# EAGLE design sch_v4_cdr (EAGLE 9.6.2)

## Sheet 1 of 6: SYSTEME DE DEMARRAGE
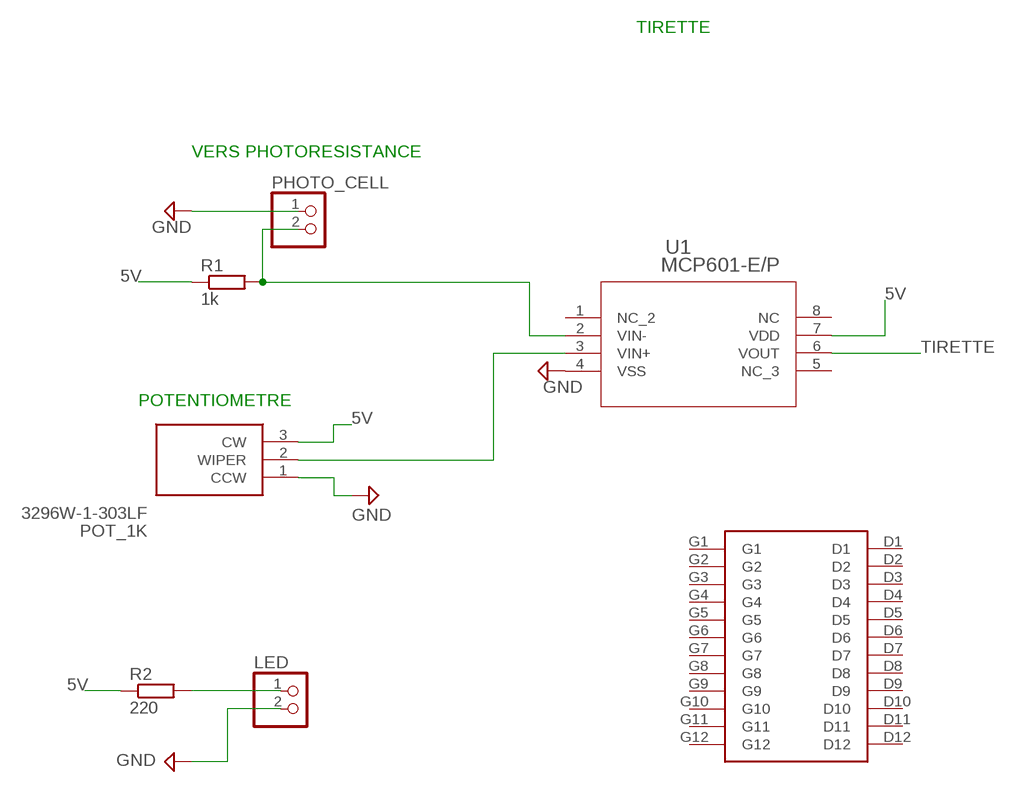
[diagram p0: schematic, sheet 1]

### Parts
LED  PINHD-1X2  [1X02]
PHOTO_CELL  PINHD-1X2  [1X02]
POT_1K  3296W-1-303LF  [3296W-1]
R1  1k  R-EU_0204/7  [0204/7]
R2  220  R-EU_0204/7  [0204/7]
U1  MCP601-E/P  [PDIP8_300MC_MCH]
U$5  MATRIX_12X12  [MATRIX_12X12]

### Nets
5V: POT_1K.3(CW) R1.1 R2.1 U1.7(VDD) ; also sheet 2,4,5
GND: LED.2 PHOTO_CELL.1 POT_1K.1(CCW) U1.4(VSS) ; also sheet 2,3,4,5,6
N$1: PHOTO_CELL.2 R1.2 U1.2(VIN-)
N$2: POT_1K.2(WIPER) U1.3(VIN+)
N$3: LED.1 R2.2
TIRETTE: U1.6(VOUT) ; also sheet 2
Unconnected: U1.1(NC_2) U1.5(NC_3) U1.8(NC) U$5.D1 U$5.D2 U$5.D3 U$5.D4 U$5.D5 U$5.D6 U$5.D7 U$5.D8 U$5.D9 U$5.D10 U$5.D11 U$5.D12 U$5.G1 U$5.G2 U$5.G3 U$5.G4 U$5.G5 U$5.G6 U$5.G7 U$5.G8 U$5.G9 U$5.G10 U$5.G11 U$5.G12

### Notes on the sheet
- TIRETTE
- VERS PHOTORESISTANCE
- POTENTIOMETRE

## Sheet 2 of 6: INTELLIGENCE
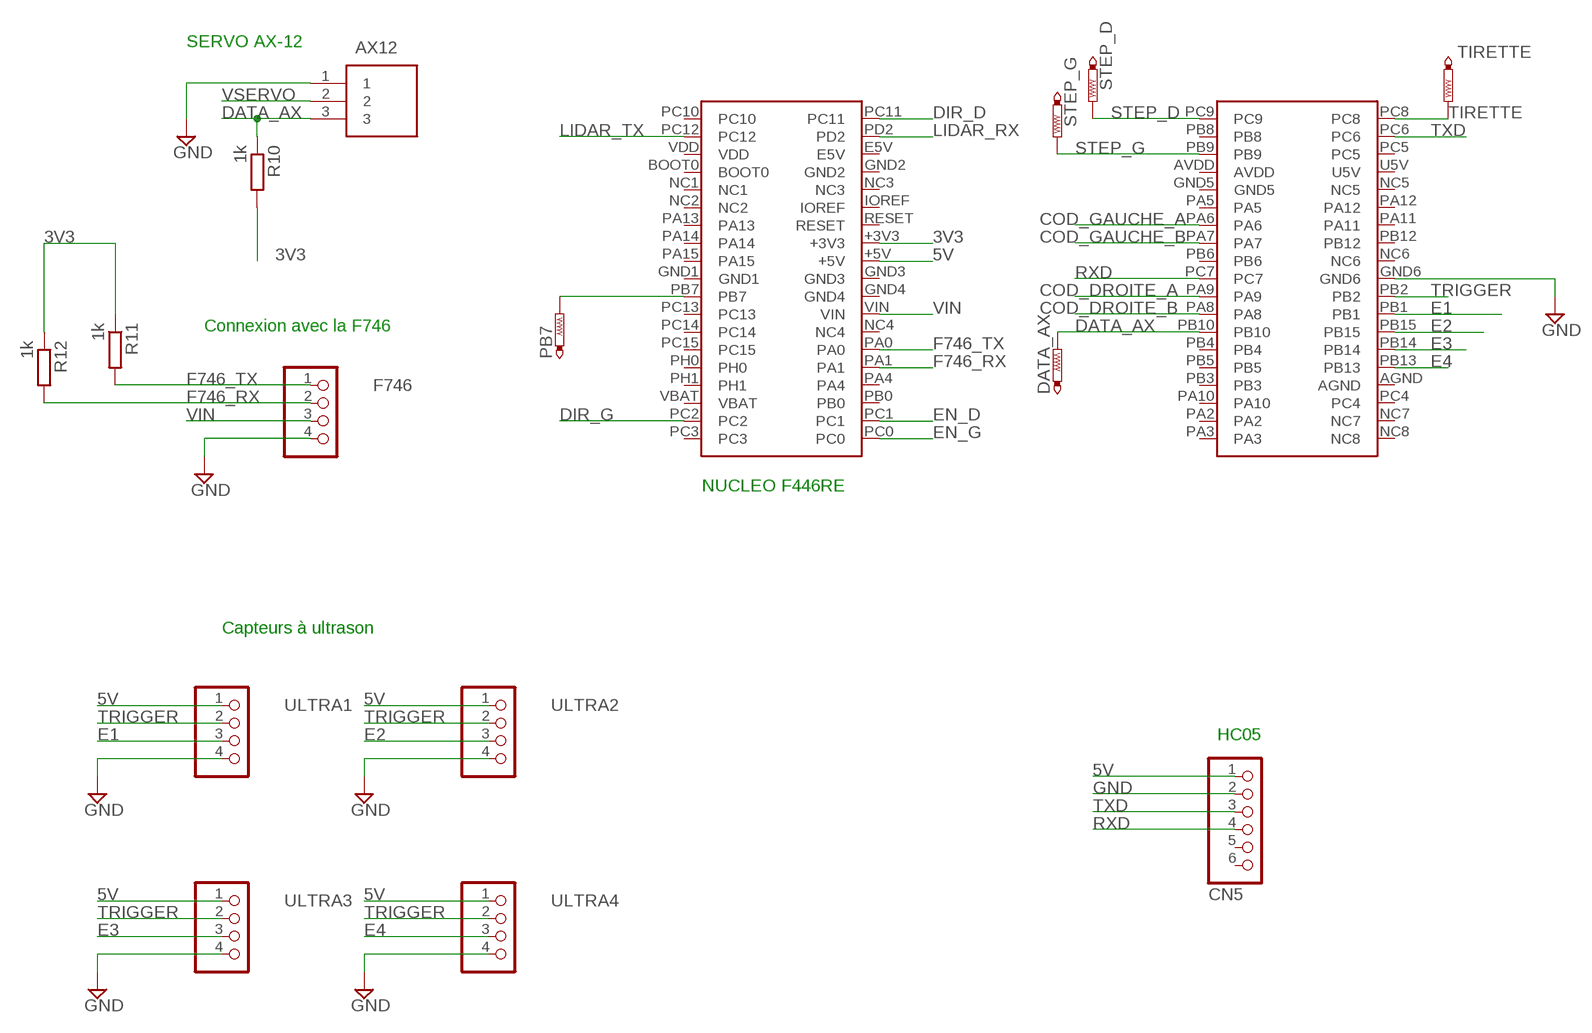
[diagram p1: schematic, sheet 2]

### Parts
AX12  22-03-5035  [SHDR3W60P0X250_1X3_990X490X590]
DATA_AX  PTR1PAD1-13  [P1-13]
F746  PINHD-1X4  [1X04]
JP4  CN5  PINHD-1X6  [1X06]
PB7  PTR1PAD1-13  [P1-13]
R10  1k  R-EU_0204/7  [0204/7]
R11  1k  R-EU_0204/7  [0204/7]
R12  1k  R-EU_0204/7  [0204/7]
STEP_D  PTR1PAD1-13  [P1-13]
STEP_G  PTR1PAD1-13  [P1-13]
TIRETTE  PTR1PAD1-13  [P1-13]
U$1  NUCLEO_F446RE  [MB1136]
ULTRA1  PINHD-1X4  [1X04]
ULTRA2  PINHD-1X4  [1X04]
ULTRA3  PINHD-1X4  [1X04]
ULTRA4  PINHD-1X4  [1X04]

### Nets
3V3: R10.2 R11.1 R12.1 U$1.+3V3
5V: JP4.1 U$1.+5V ULTRA1.1 ULTRA2.1 ULTRA3.1 ULTRA4.1 ; also sheet 1,4,5
COD_DROITE_A: U$1.PA9 ; also sheet 5
COD_DROITE_B: U$1.PA8 ; also sheet 5
COD_GAUCHE_A: U$1.PA6 ; also sheet 5
COD_GAUCHE_B: U$1.PA7 ; also sheet 5
DATA_AX: AX12.3 DATA_AX.TP R10.1 U$1.PB10
DIR_D: U$1.PC11 ; also sheet 4
DIR_G: U$1.PC2 ; also sheet 4
E1: U$1.PB1 ULTRA1.3
E2: U$1.PB15 ULTRA2.3
E3: U$1.PB14 ULTRA3.3
E4: U$1.PB13 ULTRA4.3
EN_D: U$1.PC1 ; also sheet 4
EN_G: U$1.PC0 ; also sheet 4
F746_RX: F746.2 R12.2 U$1.PA1
F746_TX: F746.1 R11.2 U$1.PA0
GND: AX12.1 F746.4 JP4.2 U$1.GND6 ULTRA1.4 ULTRA2.4 ULTRA3.4 ULTRA4.4 ; also sheet 1,3,4,5,6
LIDAR_RX: U$1.PD2 ; also sheet 6
LIDAR_TX: U$1.PC12 ; also sheet 6
N$4: PB7.TP U$1.PB7
RXD: JP4.4 U$1.PC7
STEP_D: STEP_D.TP U$1.PC9 ; also sheet 4
STEP_G: STEP_G.TP U$1.PB9 ; also sheet 4
TIRETTE: TIRETTE.TP U$1.PC8 ; also sheet 1
TRIGGER: U$1.PB2 ULTRA1.2 ULTRA2.2 ULTRA3.2 ULTRA4.2
TXD: JP4.3 U$1.PC6
VIN: F746.3 U$1.VIN ; also sheet 3,6
VSERVO: AX12.2 ; also sheet 3,6
Unconnected: JP4.5 JP4.6 U$1.AGND U$1.AVDD U$1.BOOT0 U$1.E5V U$1.GND1 U$1.GND2 U$1.GND3 U$1.GND4 U$1.GND5 U$1.IOREF U$1.NC1 U$1.NC2 U$1.NC3 U$1.NC4 U$1.NC5 U$1.NC6 U$1.NC7 U$1.NC8 U$1.PA2 U$1.PA3 U$1.PA4 U$1.PA5 U$1.PA10 U$1.PA11 U$1.PA12 U$1.PA13 U$1.PA14 U$1.PA15 U$1.PB0 U$1.PB3 U$1.PB4 U$1.PB5 U$1.PB6 U$1.PB8 U$1.PB12 U$1.PC3 U$1.PC4 U$1.PC5 U$1.PC10 U$1.PC13 U$1.PC14 U$1.PC15 U$1.PH0 U$1.PH1 U$1.RESET U$1.U5V U$1.VBAT U$1.VDD

### Notes on the sheet
- SERVO AX-12
- Connexion avec la F746
- NUCLEO F446RE
- Capteurs à ultrason
- HC05

## Sheet 3 of 6: ALIMENTATION
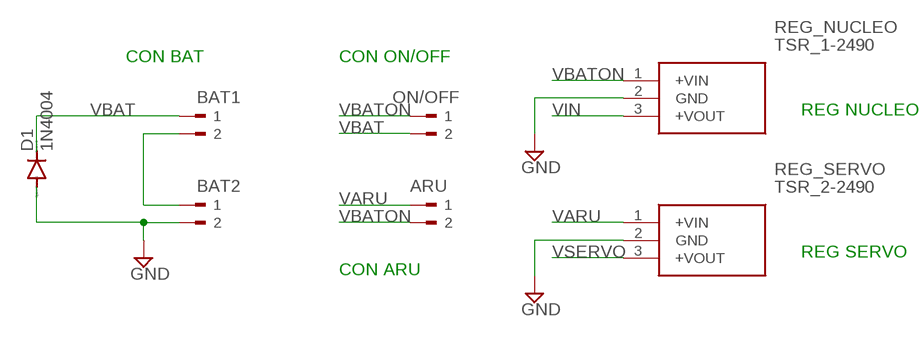
[diagram p2: schematic, sheet 3]

### Parts
ARU  180G-2  [180G-2]
BAT1  180G-2  [180G-2]
BAT2  180G-2  [180G-2]
D1  1N4004  [DO41-10]
ON/OFF  180G-2  [180G-2]
REG_NUCLEO  TSR_1-2490  [TSR_1-24XX]
REG_SERVO  TSR_2-2490  [TSR_2-24XX]

### Nets
GND: BAT2.2 D1.A REG_NUCLEO.2(GND) REG_SERVO.2(GND) ; also sheet 1,2,4,5,6
N$5: BAT1.2 BAT2.1
VARU: ARU.1 REG_SERVO.1(+VIN) ; also sheet 4
VBAT: BAT1.1 D1.C ON/OFF.2
VBATON: ARU.2 ON/OFF.1 REG_NUCLEO.1(+VIN)
VIN: REG_NUCLEO.3(+VOUT) ; also sheet 2,6
VSERVO: REG_SERVO.3(+VOUT) ; also sheet 2,6

### Notes on the sheet
- CON BAT | CON ON/OFF
- REG NUCLEO
- REG SERVO
- CON ARU

## Sheet 4 of 6: MOTORISATION DU ROBOT
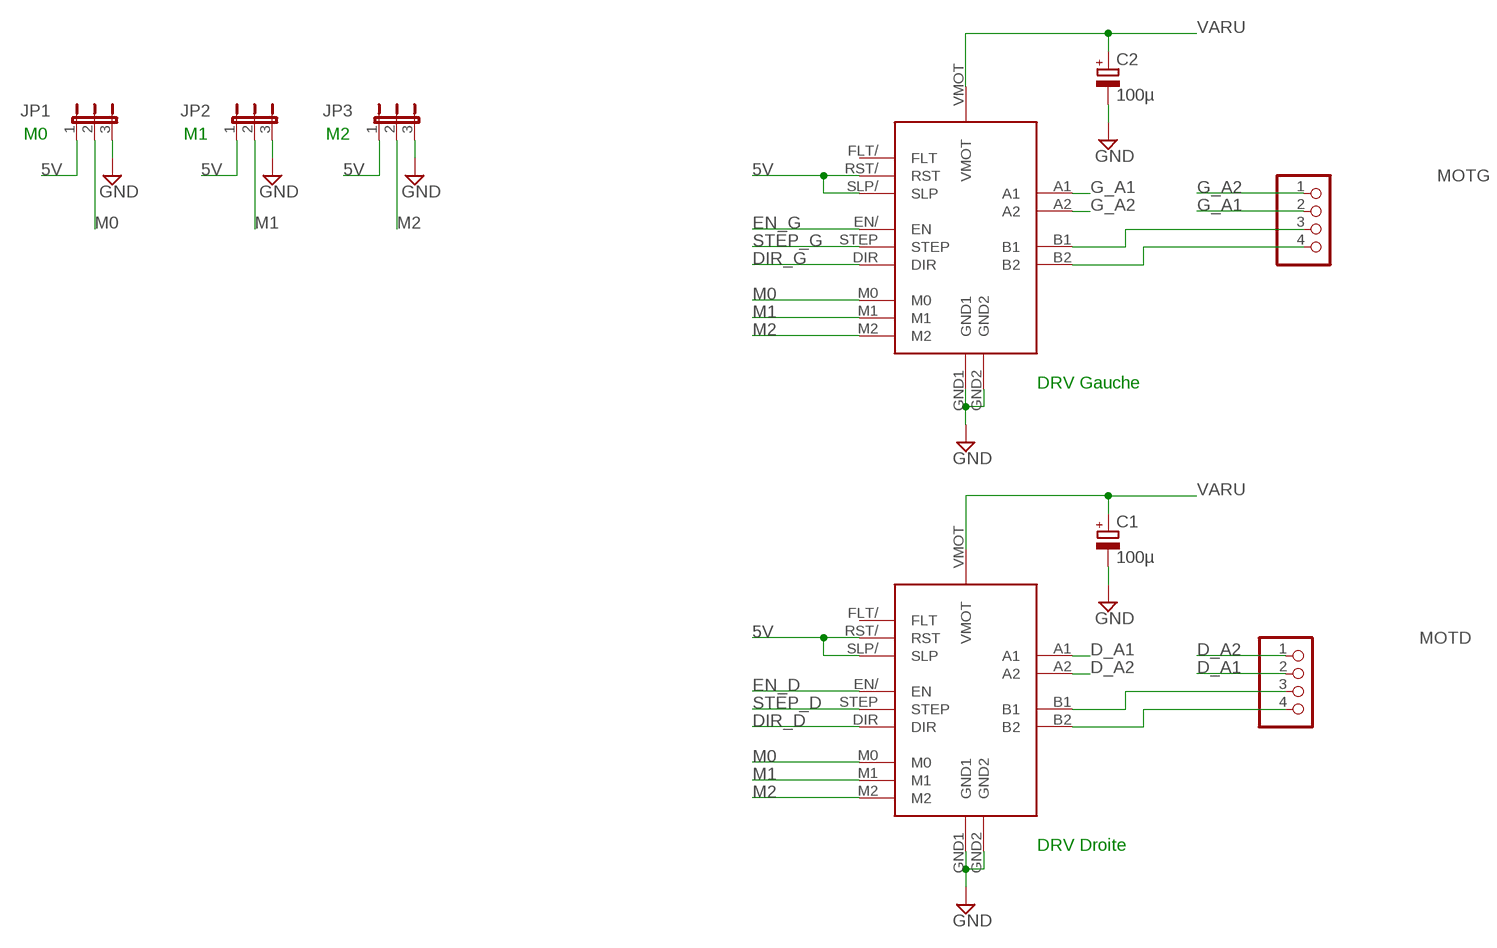
[diagram p3: schematic, sheet 4]

### Parts
C1  100µ  CPOL-EUSANYO_A  [SANYO-OSCON_A]
C2  100µ  CPOL-EUSANYO_A  [SANYO-OSCON_A]
JP1  JP2E  [JP2]
JP2  JP2E  [JP2]
JP3  JP2E  [JP2]
MOTD  PINHD-1X4  [1X04]
MOTG  PINHD-1X4  [1X04]
U$2  POLOLU_DRV8825  [POLOLU_DRV8825]
U$3  POLOLU_DRV8825  [POLOLU_DRV8825]

### Nets
5V: JP1.1 JP2.1 JP3.1 U$2.RST/(RST) U$2.SLP/(SLP) U$3.RST/(RST) U$3.SLP/(SLP) ; also sheet 1,2,5
D_A1: MOTD.2 U$3.A1
D_A2: MOTD.1 U$3.A2
DIR_D: U$3.DIR ; also sheet 2
DIR_G: U$2.DIR ; also sheet 2
EN_D: U$3.EN/(EN) ; also sheet 2
EN_G: U$2.EN/(EN) ; also sheet 2
G_A1: MOTG.2 U$2.A1
G_A2: MOTG.1 U$2.A2
GND: C1.- C2.- JP1.3 JP2.3 JP3.3 U$2.GND1 U$2.GND2 U$3.GND1 U$3.GND2 ; also sheet 1,2,3,5,6
M0: JP1.2 U$2.M0 U$3.M0
M1: JP2.2 U$2.M1 U$3.M1
M2: JP3.2 U$2.M2 U$3.M2
N$6: MOTG.3 U$2.B1
N$7: MOTG.4 U$2.B2
N$8: MOTD.3 U$3.B1
N$9: MOTD.4 U$3.B2
STEP_D: U$3.STEP ; also sheet 2
STEP_G: U$2.STEP ; also sheet 2
VARU: C1.+ C2.+ U$2.VMOT U$3.VMOT ; also sheet 3
Unconnected: U$2.FLT/(FLT) U$3.FLT/(FLT)

### Notes on the sheet
- M0 | M1 | M2
- DRV Gauche
- DRV Droite

## Sheet 5 of 6: SUIVI DES DEPLACEMENTS
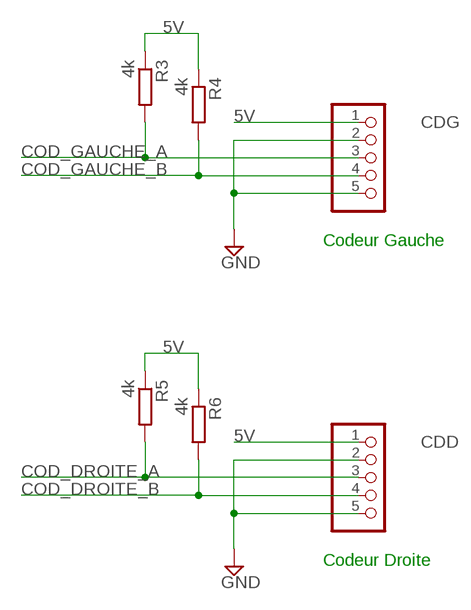
[diagram p4: schematic, sheet 5]

### Parts
CDD  PINHD-1X5  [1X05]
CDG  PINHD-1X5  [1X05]
R3  4k  R-EU_0204/7  [0204/7]
R4  4k  R-EU_0204/7  [0204/7]
R5  4k  R-EU_0204/7  [0204/7]
R6  4k  R-EU_0204/7  [0204/7]

### Nets
5V: CDD.1 CDG.1 R3.1 R4.1 R5.1 R6.1 ; also sheet 1,2,4
COD_DROITE_A: CDD.3 R5.2 ; also sheet 2
COD_DROITE_B: CDD.4 R6.2 ; also sheet 2
COD_GAUCHE_A: CDG.3 R3.2 ; also sheet 2
COD_GAUCHE_B: CDG.4 R4.2 ; also sheet 2
GND: CDD.2 CDD.5 CDG.2 CDG.5 ; also sheet 1,2,3,4,6

### Notes on the sheet
- Codeur Gauche
- Codeur Droite

## Sheet 6 of 6: LIDAR
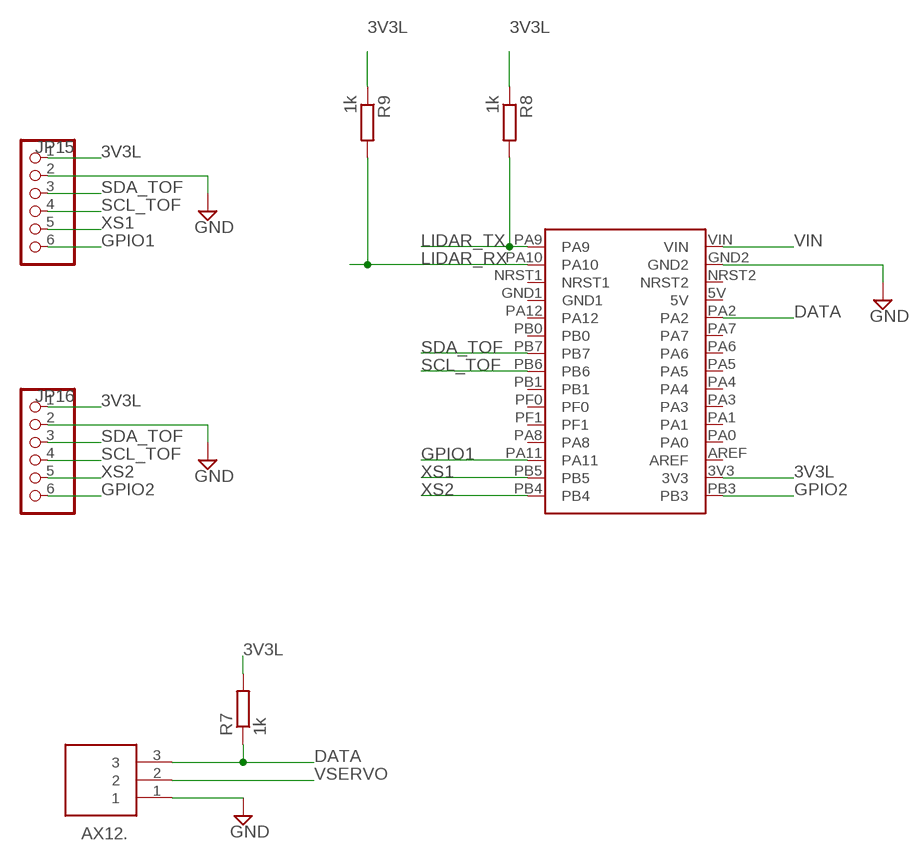
[diagram p5: schematic, sheet 6]

### Parts
AX12.  22-03-5035  [SHDR3W60P0X250_1X3_990X490X590]
JP15  PINHD-1X6  [1X06]
JP16  PINHD-1X6  [1X06]
R7  1k  R-EU_0204/7  [0204/7]
R8  1k  R-EU_0204/7  [0204/7]
R9  1k  R-EU_0204/7  [0204/7]
U$4  NUCLEO_F303K8  [MB1180]

### Nets
3V3L: JP15.1 JP16.1 R7.2 R8.1 R9.1 U$4.3V3
DATA: AX12..3 R7.1 U$4.PA2
GND: AX12..1 JP15.2 JP16.2 U$4.GND2 ; also sheet 1,2,3,4,5
GPIO1: JP15.6 U$4.PA11
GPIO2: JP16.6 U$4.PB3
LIDAR_RX: R9.2 U$4.PA10 ; also sheet 2
LIDAR_TX: R8.2 U$4.PA9 ; also sheet 2
SCL_TOF: JP15.4 JP16.4 U$4.PB6
SDA_TOF: JP15.3 JP16.3 U$4.PB7
VIN: U$4.VIN ; also sheet 2,3
VSERVO: AX12..2 ; also sheet 2,3
XS1: JP15.5 U$4.PB5
XS2: JP16.5 U$4.PB4
Unconnected: U$4.5V U$4.AREF U$4.GND1 U$4.NRST1 U$4.NRST2 U$4.PA0 U$4.PA1 U$4.PA3 U$4.PA4 U$4.PA5 U$4.PA6 U$4.PA7 U$4.PA8 U$4.PA12 U$4.PB0 U$4.PB1 U$4.PF0 U$4.PF1

## Library data of the parts
ARU BAT1 BAT2 ON/OFF = con-weidmueller-sl35:180G-2: WEIDMUELLER CLAMP CONNECTOR; OC_FARNELL: unknown; OC_NEWARK: unknown
AX12 AX12. = SamacSys_Parts:22-03-5035: Header 2.5mm SPOX,WTB,vert, shrouded, 3w Molex SPOX Series, Series Number 5267, 2.5mm Pitch 3 Way 1 Row Straight PCB Header, Solder Termination, 3A Source: Datasheet <http://uk.rs-online.com/web/p/products/6878048P>; ALLIED_NUMBER: 70248167; DESCRIPTION: Header 2.5mm SPOX,WTB,vert, shrouded, 3w Molex SPOX Series, Series Number 5267, 2.5mm Pitch 3 Way 1 Row Straight PCB Header, Solder Termination, 3A; HEIGHT: 5.9mm; MANUFACTURER_NAME: Molex; MANUFACTURER_PART_NUMBER: 22-03-5035; RS_PART_NUMBER: 6878048P; RS_PRICE-STOCK: http://uk.rs-online.com/web/p/products/6878048P
C1 C2 = rcl:CPOL-EU: POLARIZED CAPACITOR, European symbol; SPICEPREFIX: C
CDD CDG = pinhead:PINHD-1X5: PIN HEADER
D1 = diode:1N4004: DIODE general purpose rectifier, 1 A
DATA_AX PB7 STEP_D STEP_G TIRETTE = testpad:PTR1: TEST PIN
F746 MOTD MOTG ULTRA1-ULTRA4 = pinhead:PINHD-1X4: PIN HEADER
JP1-JP3 = jumper:JP2E: JUMPER
JP4 JP15 JP16 = pinhead:PINHD-1X6: PIN HEADER
LED PHOTO_CELL = pinhead:PINHD-1X2: PIN HEADER
POT_1K = SamacSys_Parts:3296W-1-303LF: Bourns 3296W Series 25-Turn Through Hole Cermet Trimmer Resistor with Solder Pin Terminations, 30k +/-10% 0.5W +/-100ppm/C Source: Datasheet <https://www.bourns.com/pdfs/3296.pdf>; ARROW_PART_NUMBER: 3296W-1-303LF; ARROW_PRICE-STOCK: https://www.arrow.com/en/products/3296w-1-303lf/bourns; DESCRIPTION: Bourns 3296W Series 25-Turn Through Hole Cermet Trimmer Resistor with Solder Pin Terminations, 30k +/-10% 0.5W +/-100ppm/C; HEIGHT: mm; MANUFACTURER_NAME: Bourns; MANUFACTURER_PART_NUMBER: 3296W-1-303LF; MOUSER_PART_NUMBER: 652-3296W-1-303LF; MOUSER_PRICE-STOCK: https://www.mouser.co.uk/ProductDetail/Bourns/3296W-1-303LF?qs=1G4X78fplldRd8Pf3DvnTA%3D%3D
R1-R12 = rcl:R-EU_: RESISTOR, European symbol; SPICEPREFIX: R
REG_NUCLEO = Traco_Power:TSR_1-2490
REG_SERVO = Traco_Power:TSR_2-2490: Non-Isolated DC/DC Converters 12-36Vin 9V 2A SIP switching regulator Source: Datasheet <https://assets.tracopower.com/20180409093301/TSR2/documents/tsr2-datasheet.pdf>; DESCRIPTION: Non-Isolated DC/DC Converters 12-36Vin 9V 2A SIP switching regulator; HEIGHT: 10.6mm; MANUFACTURER_NAME: Traco Power; MANUFACTURER_PART_NUMBER: TSR 2-2490; MOUSER_PART_NUMBER: 495-TSR2-2490; MOUSER_PRICE-STOCK: https://www.mouser.co.uk/ProductDetail/TRACO-Power/TSR-2-2490?qs=NtE2QagKf6T%2F%252B4cKUWVBJQ%3D%3D
U1 = MPC601:MCP601-E/P; BUILT_BY: EMA_Jessica; COPYRIGHT: Copyright (C) 2018 Accelerated Designs. All rights reserved; MANUFACTURER_PART_NUMBER: MCP601-E/P; SOURCELIBRARY: Microchip_2019-08-23_6; VENDOR: Microchip
U$1 = NUCLEO_boards:NUCLEO_F446RE
U$2 U$3 = Pololu:POLOLU_DRV8825
U$4 = NUCLEO_boards:NUCLEO_F303K8
U$5 = Matrix:MATRIX_12X12

## Board
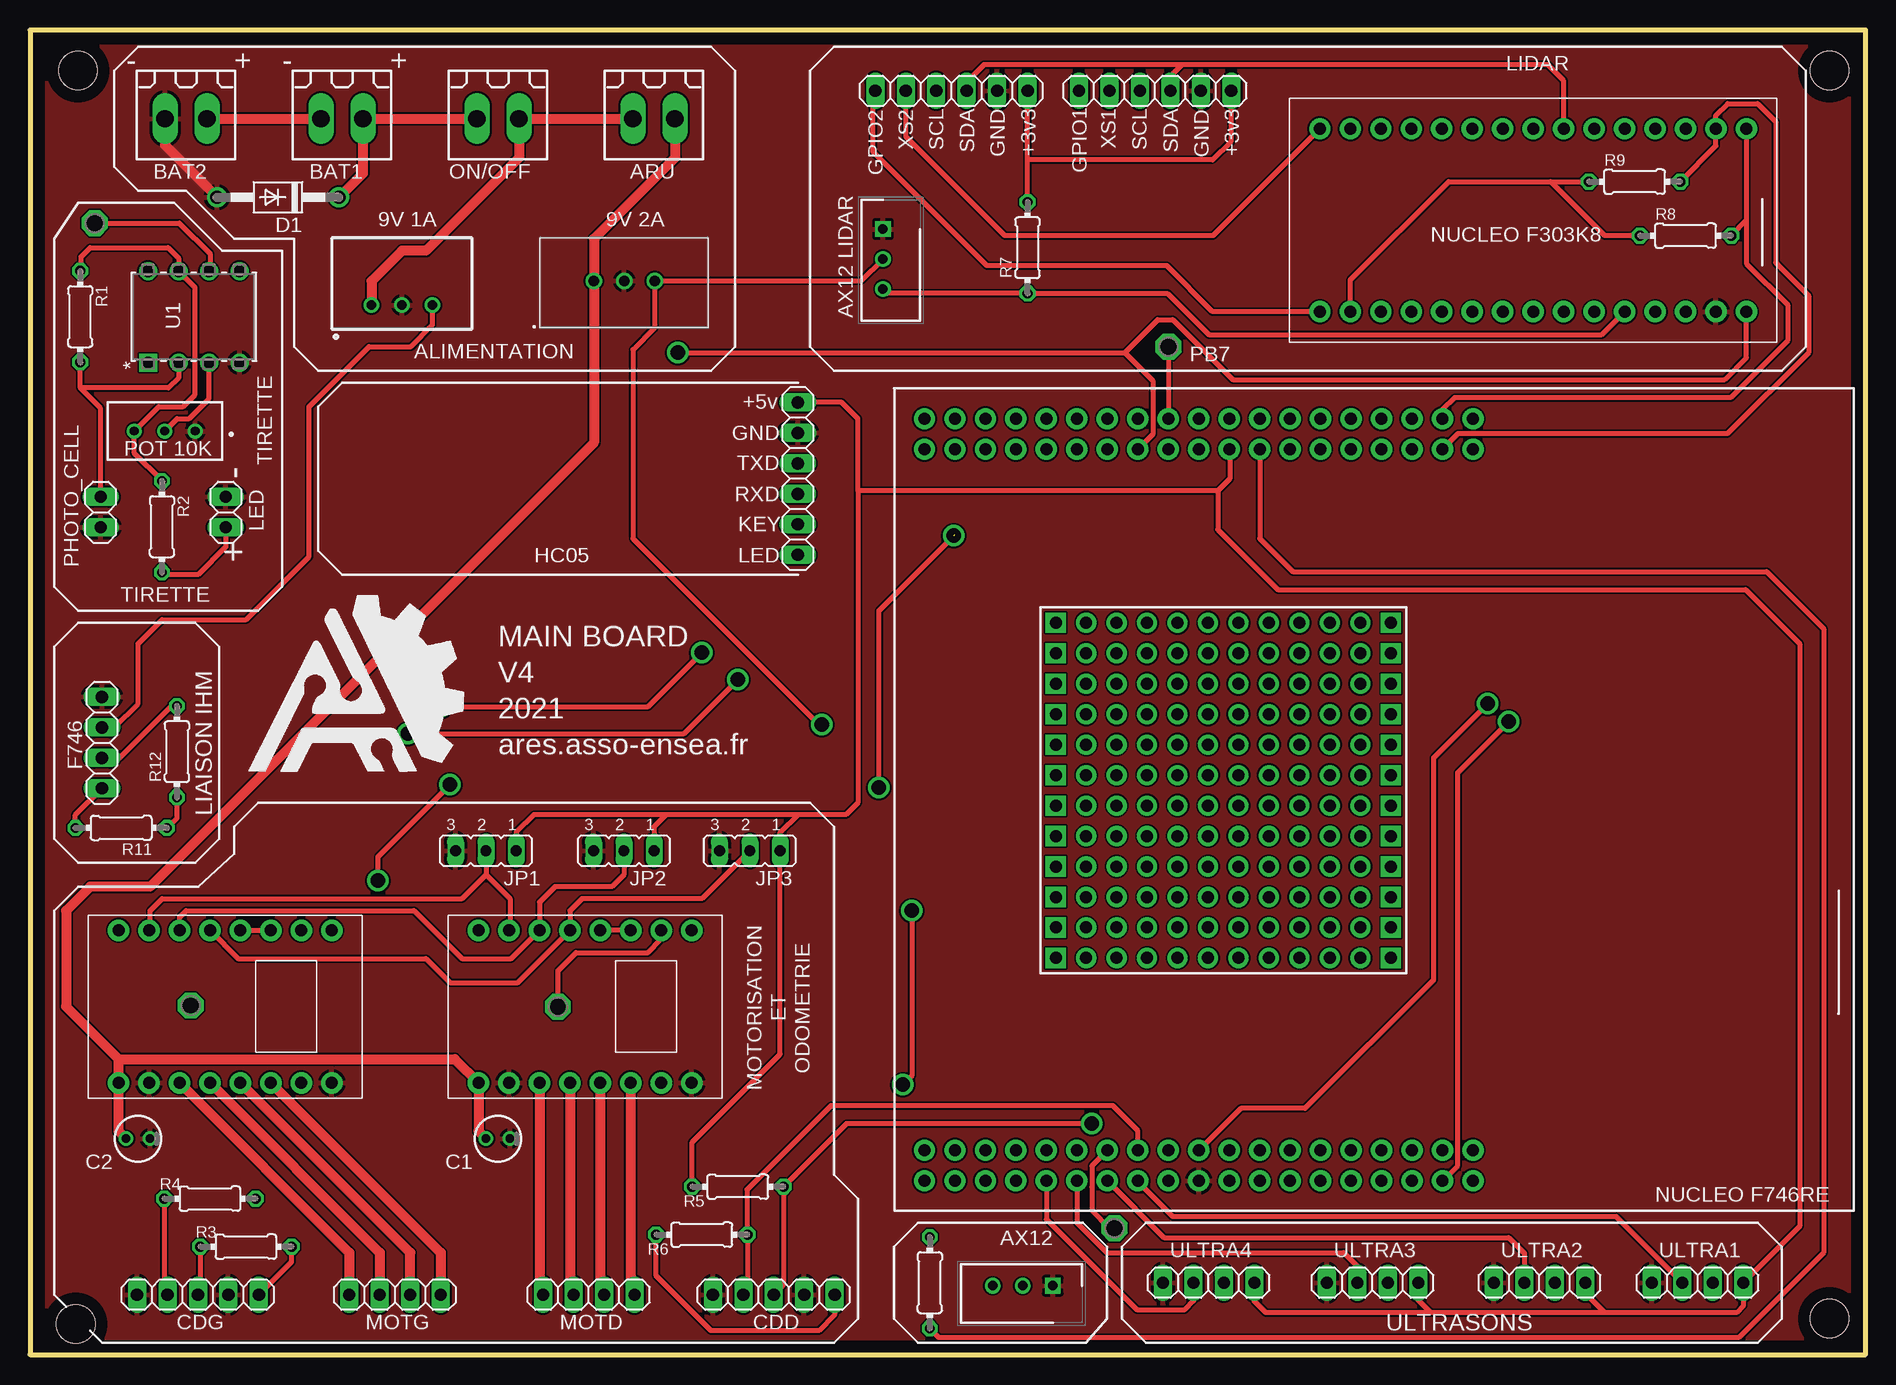
[diagram p6: board, top side]
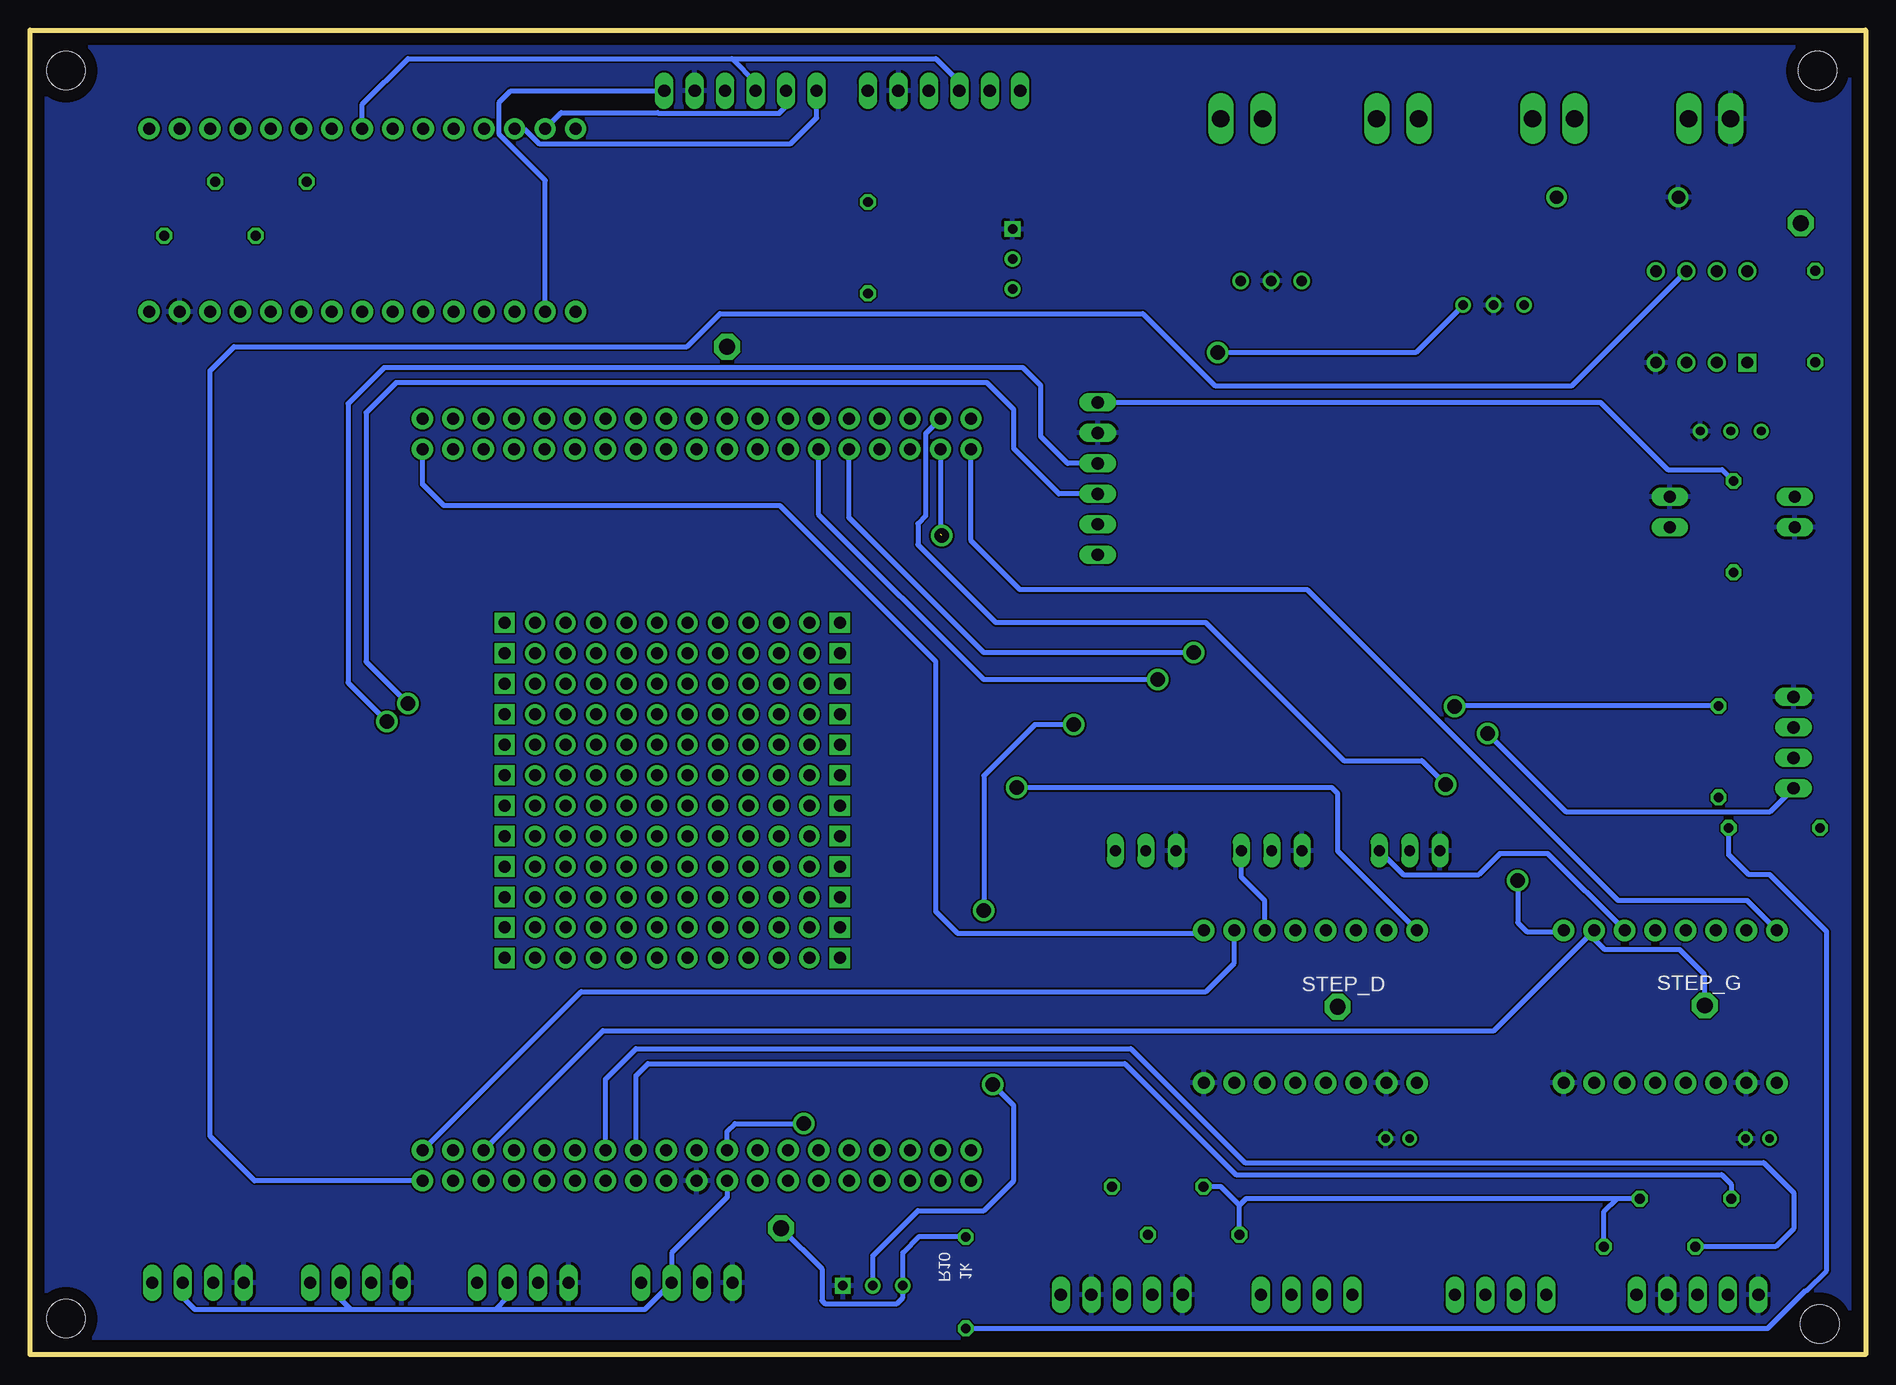
[diagram p7: board, bottom side, seen from below]

Size 153 x 110.39 mm. Coordinates in mm from the lower left corner, seen from the top.
Outline: 0,0 153,0 153,110.39 0,110.39 0,0
Copper layers (1*16): Top 0.035mm / dielectric 1.5mm / Bottom 0.035mm
Design rules "default": minimum track width 6mil, minimum drill 0.35mm, track to track 6mil, track to pad 6mil, pad to pad 6mil, via to via 6mil, smd to smd 6mil, copper to edge 40mil, drill to drill 6mil, minimum pad ring 10mil, minimum via ring 8mil, stop-mask expansion 4mil, vias tented up to drill 0mil, thermal gap 10mil
Holes 3.2 mm at 3.81,2.54 4,107 150,107 150,3

### Footprints (pad centres in the part's own frame; a part is rotated, then mirrored left to right if it is on the bottom)
180G-2 = drill 1.422 long: 1 -1.75,0; 2 1.75,0
SHDR3W60P0X250_1X3_990X490X590 = drill 0.8 pad 1.2 square: 1 0,0 | drill 0.8 pad 1.2: 2 -2.5,0; 3 -5,0
SANYO-OSCON_A = drill 0.7 pad 1.1: + 1,0; - -1,0
1X05 = drill 1.016 long: 1 -5.08,0; 2 -2.54,0; 3 0,0; 4 2.54,0; 5 5.08,0
DO41-10 = drill 1.118: A 5.08,0; C -5.08,0
P1-13 = drill 1.321 pad 2.159 octagon: TP 0,0
1X04 = drill 1.016 long: 1 -3.81,0; 2 -1.27,0; 3 1.27,0; 4 3.81,0
JP2 = drill 0.914 long: 1 -2.54,0; 2 0,0; 3 2.54,0
1X06 = drill 1.016 long: 1 -6.35,0; 2 -3.81,0; 3 -1.27,0; 4 1.27,0; 5 3.81,0; 6 6.35,0
1X02 = drill 1.016 long: 1 -1.27,0; 2 1.27,0
3296W-1 = drill 0.74 pad 1.24: 1 -2.54,0; 2 0,0; 3 2.54,0
0204/7 = drill 0.813 octagon: 1 -3.81,0; 2 3.81,0
TSR_1-24XX = drill 0.78 pad 1.28: 1 -2.54,-2.54; 2 0,-2.54; 3 2.54,-2.54
TSR_2-24XX = drill 0.85 pad 1.381: 1 0,0; 2 2.54,0; 3 5.08,0
PDIP8_300MC_MCH = drill 0.991 pad 1.499 square: 1 0,0 | drill 0.991 pad 1.499: 2 0,-2.54; 3 0,-5.08; 4 0,-7.62; 5 7.62,-7.62; 6 7.62,-5.08; 7 7.62,-2.54; 8 7.62,0
MB1136 = drill 1 pad 1.778: +3V3 -30.48,-6.35; +5V -30.48,-8.89; AGND 30.48,-26.67; AVDD 27.94,3.81; BOOT0 -33.02,3.81; E5V -30.48,6.35; GND1 -33.02,-11.43; GND2 -30.48,3.81; GND3 -30.48,-11.43; GND4 -30.48,-13.97; GND5 27.94,1.27; GND6 30.48,-11.43; IOREF -30.48,-1.27; NC1 -33.02,1.27; NC2 -33.02,-1.27; NC3 -30.48,1.27; NC4 -30.48,-19.05; NC5 30.48,1.27; NC6 30.48,-8.89; NC7 30.48,-31.75; NC8 30.48,-34.29; PA0 -30.48,-21.59; PA1 -30.48,-24.13; PA2 27.94,-31.75; PA3 27.94,-34.29; PA4 -30.48,-26.67; PA5 27.94,-1.27; PA6 27.94,-3.81; PA7 27.94,-6.35; PA8 27.94,-16.51; PA9 27.94,-13.97; PA10 27.94,-29.21; PA11 30.48,-3.81; PA12 30.48,-1.27; PA13 -33.02,-3.81; PA14 -33.02,-6.35; PA15 -33.02,-8.89; PB0 -30.48,-29.21; PB1 30.48,-16.51; PB2 30.48,-13.97; PB3 27.94,-26.67; PB4 27.94,-21.59; PB5 27.94,-24.13; PB6 27.94,-8.89; PB7 -33.02,-13.97; PB8 27.94,8.89; PB9 27.94,6.35; PB10 27.94,-19.05; PB12 30.48,-6.35; PB13 30.48,-24.13; PB14 30.48,-21.59; PB15 30.48,-19.05; PC0 -30.48,-34.29; PC1 -30.48,-31.75; PC2 -33.02,-31.75; PC3 -33.02,-34.29; PC4 30.48,-29.21; PC5 30.48,6.35; PC6 30.48,8.89; PC7 27.94,-11.43; PC8 30.48,11.43; PC9 27.94,11.43; PC10 -33.02,11.43; PC11 -30.48,11.43; PC12 -33.02,8.89; PC13 -33.02,-16.51; PC14 -33.02,-19.05; PC15 -33.02,-21.59; PD2 -30.48,8.89; PH0 -33.02,-24.13; PH1 -33.02,-26.67; RESET -30.48,-3.81; U5V 30.48,3.81; VBAT -33.02,-29.21; VDD -33.02,6.35; VIN -30.48,-16.51
POLOLU_DRV8825 = drill 1 pad 1.778: A1 -6.35,-2.54; A2 -6.35,-5.08; B1 -6.35,0; B2 -6.35,2.54; DIR 6.35,-10.16; EN/ 6.35,7.62; FLT/ -6.35,-7.62; GND1 -6.35,5.08; GND2 -6.35,-10.16; M0 6.35,5.08; M1 6.35,2.54; M2 6.35,0; RST/ 6.35,-2.54; SLP/ 6.35,-5.08; STEP 6.35,-7.62; VMOT -6.35,7.62
MB1180 = drill 1 pad 1.778: 3V3 7.62,-13.97; 5V 7.62,11.43; AREF 7.62,-11.43; GND1 -7.62,11.43; GND2 7.62,16.51; NRST1 -7.62,13.97; NRST2 7.62,13.97; PA0 7.62,-8.89; PA1 7.62,-6.35; PA2 7.62,8.89; PA3 7.62,-3.81; PA4 7.62,-1.27; PA5 7.62,1.27; PA6 7.62,3.81; PA7 7.62,6.35; PA8 -7.62,-8.89; PA9 -7.62,19.05; PA10 -7.62,16.51; PA11 -7.62,-11.43; PA12 -7.62,8.89; PB0 -7.62,6.35; PB1 -7.62,-1.27; PB3 7.62,-16.51; PB4 -7.62,-16.51; PB5 -7.62,-13.97; PB6 -7.62,1.27; PB7 -7.62,3.81; PF0 -7.62,-3.81; PF1 -7.62,-6.35; VIN 7.62,19.05
MATRIX_12X12 = drill 1 pad 1.676 square: D1 27.94,0; D2 27.94,-2.54; D3 27.94,-5.08; D4 27.94,-7.62; D5 27.94,-10.16; D6 27.94,-12.7; D7 27.94,-15.24; D8 27.94,-17.78; D9 27.94,-20.32; D10 27.94,-22.86; D11 27.94,-25.4; D12 27.94,-27.94; G1 0,0; G2 0,-2.54; G3 0,-5.08; G4 0,-7.62; G5 0,-10.16; G6 0,-12.7; G7 0,-15.24; G8 0,-17.78; G9 0,-20.32; G10 0,-22.86; G11 0,-25.4; G12 0,-27.94 | drill 1 pad 1.676: P$1 2.54,-20.32; P$2 2.54,-22.86; P$3 2.54,-25.4; P$4 2.54,-27.94; P$5 5.08,-20.32; P$6 5.08,-22.86; P$7 5.08,-25.4; P$8 5.08,-27.94; P$9 2.54,0; P$10 2.54,-2.54; P$11 2.54,-5.08; P$12 2.54,-7.62; P$13 2.54,-10.16; P$14 2.54,-12.7; P$15 2.54,-15.24; P$16 2.54,-17.78; P$17 5.08,0; P$18 5.08,-2.54; P$19 5.08,-5.08; P$20 5.08,-7.62; P$21 5.08,-10.16; P$22 5.08,-12.7; P$23 5.08,-15.24; P$24 5.08,-17.78; P$25 7.62,0; P$26 7.62,-2.54; P$27 7.62,-5.08; P$28 7.62,-7.62; P$29 7.62,-10.16; P$30 7.62,-12.7; P$31 7.62,-15.24; P$32 7.62,-17.78; P$33 10.16,0; P$34 10.16,-2.54; P$35 10.16,-5.08; P$36 10.16,-7.62; P$37 10.16,-10.16; P$38 10.16,-12.7; P$39 10.16,-15.24; P$40 10.16,-17.78; P$41 12.7,0; P$42 12.7,-2.54; P$43 12.7,-5.08; P$44 12.7,-7.62; P$45 12.7,-10.16; P$46 12.7,-12.7; P$47 12.7,-15.24; P$48 12.7,-17.78; P$49 15.24,0; P$50 15.24,-2.54; P$51 15.24,-5.08; P$52 15.24,-7.62; P$53 15.24,-10.16; P$54 15.24,-12.7; P$55 15.24,-15.24; P$56 15.24,-17.78; P$57 7.62,-20.32; P$58 7.62,-22.86; P$59 7.62,-25.4; P$60 7.62,-27.94; P$61 10.16,-20.32; P$62 10.16,-22.86; P$63 10.16,-25.4; P$64 10.16,-27.94; P$65 12.7,-20.32; P$66 12.7,-22.86; P$67 12.7,-25.4; P$68 12.7,-27.94; P$69 15.24,-20.32; P$70 15.24,-22.86; P$71 15.24,-25.4; P$72 15.24,-27.94; P$73 17.78,0; P$74 17.78,-2.54; P$75 17.78,-5.08; P$76 17.78,-7.62; P$77 17.78,-10.16; P$78 17.78,-12.7; P$79 17.78,-15.24; P$80 17.78,-17.78; P$81 20.32,0; P$82 20.32,-2.54; P$83 20.32,-5.08; P$84 20.32,-7.62; P$85 20.32,-10.16; P$86 20.32,-12.7; P$87 20.32,-15.24; P$88 20.32,-17.78; P$89 22.86,0; P$90 22.86,-2.54; P$91 22.86,-5.08; P$92 22.86,-7.62; P$93 22.86,-10.16; P$94 22.86,-12.7; P$95 22.86,-15.24; P$96 22.86,-17.78; P$97 25.4,0; P$98 25.4,-2.54; P$99 25.4,-5.08; P$100 25.4,-7.62; P$101 25.4,-10.16; P$102 25.4,-12.7; P$103 25.4,-15.24; P$104 25.4,-17.78; P$105 17.78,-20.32; P$106 17.78,-22.86; P$107 17.78,-25.4; P$108 20.32,-20.32; P$109 20.32,-22.86; P$110 20.32,-25.4; P$111 22.86,-20.32; P$112 22.86,-22.86; P$113 22.86,-25.4; P$114 25.4,-20.32; P$115 25.4,-22.86; P$116 25.4,-25.4; P$117 17.78,-27.94; P$118 20.32,-27.94; P$119 22.86,-27.94; P$120 25.4,-27.94

### Placement (x,y rotation side)
ARU  52,103 180 top
AX12  85.25,5.75 0 top
AX12.  71.1,93.8 90 top
BAT1  26,103 180 top
BAT2  13,103 180 top
C1  39,18 180 top
C2  9,18 180 top
CDD  62,5 180 top
CDG  14,5 180 top
D1  20.67,96.45 180 top
DATA_AX  90.4,10.55 0 top
F746  6,51 90 top
JP1  38,42 180 top
JP2  49.5,42 180 top
JP3  60,42 180 top
JP4  64,73 270 top
JP15  93.78,105.32 180 top
JP16  76.81,105.32 180 top
LED  16.32,70.22 90 top
MOTD  46.58,5 180 top
MOTG  30.42,5 180 top
ON/OFF  39,103 180 top
PB7  94.9,84 0 top
PHOTO_CELL  5.89,70.22 90 top
POT_1K  11.24,76.97 180 top
R1  4.19,86.51 270 top
R2  11,69 270 top
R3  18,9 180 top
R4  15,13 180 top
R5  59,14 0 top
R6  56,10 0 top
R7  83.15,92.25 90 top
R8  138,93.25 0 top
R9  133.75,97.75 0 top
R10  75,6 270 top
R11  7.6,43.9 180 top
R12  12.25,50.25 90 top
REG_NUCLEO  31,90 0 top
REG_SERVO  47,89.48 0 top
STEP_D  44,29 0 top
STEP_G  13.4,29.1 0 top
TIRETTE  5.4,94.3 0 top
U1  9.84,82.68 90 top
U$1  108.85,44.97 270 top
U$2  15,29 90 top
U$3  45,29 90 top
U$4  124.03,94.54 270 top
U$5  85.5,61 0 top
ULTRA1  139,6 180 top
ULTRA2  125.83,6 180 top
ULTRA3  111.92,6 180 top
ULTRA4  98.25,6 180 top

### Tracks (layer width: path | path; a pad name or v marks a point on that pad's centre or on a via)
3V3
  Top 0.406: R11.1 12.25,44.74 R12.1 | U$1.+3V3 102.5,68 105.25,65.25 144.75,65.25 149.5,60.5 149.5,8.5 142.42,1.42 75.75,1.42 75,2.17 R10.2
  Bottom 0.406: R10.2 8.15,2.19 4.98,5.36 4.89,5.36 3.25,7 3.25,35.25 8,40 9.75,40 11.41,41.66 R11.1
3V3L
  Top 0.406: 83.16,99.57 98.57,99.57 100.13,101.13 JP15.1 | R7.2 83.15,99.56 83.16,99.57 | U$4.3V3 110.06,89.56 118.25,97.75 126.75,97.75 | 126.75,97.75 R9.1 | R8.1 131.25,93.25 126.75,97.75 | 83.16,99.57 JP16.1
  Bottom 0.406: JP15.1 112.93,105.32 113.89,104.36 113.89,101.69 110.06,97.86 U$4.3V3
5V
  Top 0.406: U$1.+5V 100,75.41 100,73 99,72 | 99,72 69,72 | 69,72 69,78 67.65,79.35 JP4.1 | 64,45 53,45 | 53,45 52,44 52,42.04 JP2.1 | 64,45 62.54,43.54 JP3.1 62.54,25.04 55.19,17.69 R5.1 | 53,45 42,45 40.54,43.54 JP1.1 | 69,72 69,46 68,45 64,45 | U$3.SLP/ U$3.RST/ | U$2.RST/ U$2.SLP/ | 99,72 99,68.75 104,63.75 143,63.75 147.5,59.25 147.5,10.69 ULTRA1.1 142.81,4.06 142.25,3.5 131.25,3.5 | 131.25,3.5 116.75,3.5 | 116.75,3.5 103,3.5 102.06,4.44 ULTRA4.1 | ULTRA3.1 115.73,4.52 116.75,3.5 | ULTRA2.1 129.64,5.11 131.25,3.5 | R1.1 4.25,90.38 4.25,91.5 5,92.25 11.5,92.25 12.38,91.37 U1.7 13.75,88.93 13.75,80 12.75,79 10.73,79 POT_1K.3 8.7,75.11 R2.1 | CDG.1 21.81,7.73 R3.1 | CDD.1 67.08,3.33 65.75,2 56.75,2 52.19,6.56 R6.1
  Bottom 0.406: R3.1 21.81,11.94 20.75,13 | R4.1 20.75,13 | R6.1 52.19,12.44 | 52.19,12.44 53.75,14 R5.1 | 20.75,13 51.63,13 52.19,12.44 | JP4.1 22.1,79.35 16.5,73.75 11.94,73.75 R2.1 | U$3.SLP/ 50.08,37.83 52.04,39.79 JP2.1 | JP1.1 38.54,40 32.25,40 30.5,41.75 26.48,41.75 U$2.SLP/
COD_DROITE_A  (via drill 1.2 pad 0.4)
  Top 0.406: CDD.3 62.81,5.81 R5.2 68.06,19.25 v88.5,19.25
  Bottom 0.406: U$1.PA9 94.88,18.62 94.25,19.25 v88.5,19.25
COD_DROITE_B
  Top 0.406: CDD.4 59.81,5.35 R6.2 59.75,10.06 59.75,13.75 66.75,20.75 90.25,20.75 92.34,18.66 U$1.PA8
COD_GAUCHE_A
  Top 0.406: R3.2 14.19,5.19 CDG.3
  Bottom 0.406: U$1.PA6 105.04,22.96 102.5,25.5 61.25,25.5 51.75,16 8.5,16 6,13.5 6,10.5 7.5,9 R3.2
COD_GAUCHE_B
  Top 0.406: R4.2 11.19,5.27 CDG.4
  Bottom 0.406: U$1.PA7 102.5,23.25 101.5,24.25 61.75,24.25 52.5,15 12,15 11.19,14.19 R4.2
D_A1
  Top 0.813: U$3.A1 47.54,5.31 MOTD.2
D_A2
  Top 0.813: U$3.A2 50.08,5.31 MOTD.1
DATA
  Top 0.406: AX12..3 71.46,88.44 R7.1 94.81,88.44 98.25,85 131,85 U$4.PA2
DATA_AX
  Top 0.406: U$1.PB10 88.5,15.73 88.5,13.97 88.5,12 89.95,10.55 DATA_AX.TP
  Bottom 0.406: R10.1 78.94,9.81 80.25,8.5 AX12.3 80.25,4.75 80.75,4.25 86.75,4.25 87,4.5 87,7.15 DATA_AX.TP
DIR_D
  Bottom 0.406: U$3.DIR 55.41,35.1 75.68,35.1 77.5,36.92 77.5,57.75 90.5,70.75 118.5,70.75 120.28,72.53 U$1.PC11
DIR_G  (via drill 1.2 pad 0.4)
  Top 0.406: v29,39.5 29,41.5 v35,47.5
  Bottom 0.406: U$1.PC2 78.34,76.75 78.34,69.91 79,69.25 79,67.5 72.5,61 55,61 52.62,58.62 52.5,58.5 43.5,49.5 37,49.5 v35,47.5 | v29,39.5 29,36 28.25,35.25 25.26,35.25 U$2.DIR
E1
  Top 0.406: ULTRA1.3 132.23,11.5 95.25,11.5 92.34,14.41 U$1.PB1
E2
  Top 0.406: U$1.PB15 94.54,9.75 123.25,9.75 124.56,8.44 ULTRA2.3
E3
  Top 0.406: U$1.PB14 87.26,10.99 89.75,8.5 109.5,8.5 110.65,7.35 ULTRA3.3
E4
  Top 0.406: U$1.PB13 84.72,11.28 92.25,3.75 96.25,3.75 96.98,4.48 ULTRA4.3
EN_D  (via drill 1.2 pad 0.4)  (1 unrouted)
  Top 0.406: v70.75,47.25 70.75,62 v77,68.25
  Bottom 0.406: U$1.PC1 77.1,68.35 | U$3.EN/ 44,41.97 44,46.75 44.5,47.25 v70.75,47.25
EN_G
  Bottom 0.406: U$2.EN/ 9.88,37.85 20.63,37.85 46.53,63.75 70.5,63.75 74.56,67.81 U$1.PC0
F746_RX  (via drill 1.2 pad 0.4)
  Top 0.406: F746.2 7.48,49.73 11.81,54.06 R12.2 | v34.25,54 51.5,54 v56,58.5
  Bottom 0.406: R12.2 34.19,54.06 v34.25,54 | v56,58.5 73.5,58.5 84.75,69.75 84.75,75.42 U$1.PA1
F746_TX  (via drill 1.2 pad 0.4)
  Top 0.406: R11.2 3.79,44.98 F746.1 | v31.5,51.75 54.5,51.75 v59,56.25
  Bottom 0.406: v31.5,51.75 25,45.25 7.94,45.25 F746.1 | v59,56.25 73.5,56.25 87.26,70.01 U$1.PA0
G_A1
  Top 0.813: MOTG.2 31.69,8.5 U$2.A1
G_A2
  Top 0.813: U$2.A2 34.23,8.5 MOTG.1
GND
  Top 0.813: BAT2.2 11.25,100.79 D1.A
  pour Top: -1.75,112.5 155.75,112.5 155.75,-2.75 154.75,-3.75 -2.25,-3.75 -2.5,-4 -2.5,111.75
  pour Bottom: -3.25,114.25 156.75,114.25 158.25,112.75 158.25,-4 156.75,-5.5 -3.5,-5.5 -5,-4 -5,112.5
GPIO1
  Bottom 0.406: U$4.PA11 111.82,102.16 110.58,100.92 89.58,100.92 87.43,103.07 JP15.6
GPIO2
  Top 0.406: JP16.6 70.25,105.11 70.25,100.25 79.75,90.75 94.75,90.75 98.58,86.92 U$4.PB3
LIDAR_RX
  Top 0.406: R9.2 140.54,100.73 U$4.PA10 140.54,103.29 141.5,104.25 144,104.25 145.5,102.75 145.5,91 148.25,88.25 148.25,83.5 141.5,76.75 119.76,76.75 119.04,76.75 U$1.PD2
LIDAR_TX
  Top 0.406: R8.2 143.08,94.52 | U$4.PA9 143.08,94.52 | 143.08,94.52 143.08,90.92 146.5,87.5 146.5,84.5 141.75,79.75 118.75,79.75 117.74,78.74 U$1.PC12
M0
  Top 0.406: JP1.2 38,40 | 38,40 40,38 40,35.43 U$3.M0 | U$2.M0 10,35.43 10,37 11,38 36,38 38,40
M1
  Top 0.406: JP2.2 49.5,40 48.5,39 43.75,39 42.46,37.71 U$3.M1 40.11,33 36,33 32,37 13,37 12.46,36.46 U$2.M1
M2
  Top 0.406: JP3.2 56,38 46,38 45,37 U$3.M2 40.65,31 35,31 33,33 17.35,33 U$2.M2
N$1
  Top 0.406: PHOTO_CELL.2 5.89,78.86 4.19,80.56 | 4.19,80.56 R1.2 | U1.2 12.38,81.38 11.56,80.56 4.19,80.56
N$2
  Top 0.406: POT_1K.2 12.27,78 13.25,78 14.92,79.67 U1.3
N$3
  Top 0.406: LED.1 16.32,67.32 14,65 11.19,65 R2.2
N$4
  Top 0.406: PB7.TP 94.9,78.01 U$1.PB7
  Bottom 0.406: PB7.TP 94.88,83.98
N$5
  Top 0.813: BAT2.1 BAT1.2
N$6
  Top 0.813: U$2.B1 29.15,8.5 MOTG.3
N$7
  Top 0.813: U$2.B2 26.61,8.5 MOTG.4
N$8
  Top 0.813: U$3.B1 45,5.31 MOTD.3
N$9
  Top 0.813: U$3.B2 42.46,5.31 MOTD.4
RXD  (via drill 1.2 pad 0.4)
  Top 0.406: v121.5,54.25 117,49.75 117,31.25 106.28,20.53 100.92,20.53 U$1.PC7
  Bottom 0.406: JP4.4 67.23,71.73 71,75.5 71,78.75 73.25,81 122.5,81 125,78.5 125,57.75 v121.5,54.25
SCL_TOF
  Bottom 0.406: U$4.PB6 125.3,104.2 121.5,108 94.5,108 | 94.5,108 92.51,106.01 | 92.51,106.01 92.5,106 | JP15.4 92.51,106.01 | 94.5,108 77.5,108 75.5,106 75.5,105.36 JP16.4
SDA_TOF
  Top 0.406: U$4.PB7 127.84,106.16 126.5,107.5 96,107.5 | 96,107.5 95,106.5 95,105.37 JP15.3 | 96,107.5 79.5,107.5 78,106 78,105.4 JP16.3
STEP_D
  Top 0.406: STEP_D.TP 44,32 45.5,33.5 51.5,33.5 52.62,34.62 U$3.STEP
  Bottom 0.406: U$1.PC9 107.06,30.25 55,30.25 52.62,32.63 U$3.STEP
STEP_G
  Bottom 0.406: STEP_G.TP 13.4,31.65 15.5,33.75 21.75,33.75 22.62,34.62 U$2.STEP 30.97,27 105.23,27 U$1.PB9
TIRETTE
  Top 0.406: TIRETTE.TP 12.45,94.3 15,91.75 15,90.38 U1.6
  Bottom 0.406: U$1.PC8 134.28,14.49 138,18.21 138,82 136,84 98.25,84 95.5,86.75 60.25,86.75 54.25,80.75 24.47,80.75 U1.6
TRIGGER
  Bottom 0.406: U$1.PB2 94.88,13.12 99.52,8.48 ULTRA4.2 101.77,3.75 114.25,3.75 | ULTRA1.2 140.27,4.77 139.25,3.75 126.25,3.75 | 114.25,3.75 126.25,3.75 | ULTRA2.2 127.1,4.6 126.25,3.75 | ULTRA3.2 113.19,4.81 114.25,3.75
TXD  (via drill 1.2 pad 0.4)
  Top 0.406: U$1.PC6 119,15.75 119,48.5 v123.25,52.75
  Bottom 0.406: JP4.3 66.52,74.27 68.75,76.5 68.75,80.75 70.25,82.25 123.5,82.25 126.5,79.25 126.5,56 v123.25,52.75
VARU
  Top 0.813: ARU.1 53.75,99.75 47,93 REG_SERVO.1 47,76 10,39 5,39 3,37 3,29 7.38,24.62 | C1.+ 37.38,18.62 U$3.VMOT 35.41,24.62 7.38,24.62 | 7.38,24.62 U$2.VMOT 7.38,18.62 C2.+
VBAT
  Top 0.813: ON/OFF.2 BAT1.1 27.75,98.45 D1.C
VBATON
  Top 0.813: ARU.2 ON/OFF.1 40.75,99.75 33,92 31,92 28.46,89.46 REG_NUCLEO.1
VIN  (via drill 1.2 pad 0.4)
  Top 0.406: U$1.VIN 93.58,76.69 93.58,81.17 91.25,83.5 | U$4.VIN 143.08,83.08 141.25,81.25 100.25,81.25 95.25,86.25 94,86.25 91.25,83.5 | F746.3 7.02,52.27 9,54.25 9,59.25 11,61.25 18,61.25 23.25,66.5 23.25,79 28.25,84 31.75,84 33.54,85.79 REG_NUCLEO.3 | v54,83.5 91.25,83.5
  Bottom 0.406: REG_NUCLEO.3 37.5,83.5 v54,83.5
VSERVO  (via drill 1.2 pad 0.4)
  Top 0.406: AX12..2 69.28,89.48 REG_SERVO.3 52.08,85.58 50.25,83.75 50.25,68 65.75,52.5 v66,52.5 | v72.75,22.5 73.5,23.25 v73.5,37
  Bottom 0.406: v73.5,37 73.5,48.25 69.25,52.5 v66,52.5 | AX12.2 82.75,8.25 79,12 73.5,12 71,14.5 71,20.75 v72.75,22.5
XS1
  Bottom 0.406: U$4.PB5 108.72,103.5 100.65,103.5 100.59,103.44 90.56,103.44 89.97,104.03 JP15.5
XS2
  Top 0.406: U$4.PB4 98.61,93.25 81.25,93.25 73,101.5 JP16.5

### Text on the board
tPlace: - | + | - | + | LIDAR | XS2 | SCL | SDA | GND | +3v3 | SCL | SDA | GND | +3v3 | GPIO2 | GPIO1 | AX12 LIDAR | +5v | GND | POT 10K | TXD | RXD | KEY | HC05 | LED | ULTRASONS
tNames: XS1 | 9V 1A | 9V 2A | NUCLEO F303K8 | ALIMENTATION | - | + | TIRETTE | MAIN BOARD | LIAISON IHM | V4 | 2021 | ares.asso-ensea.fr | ET | ODOMETRIE | MOTORISATION | NUCLEO F746RE